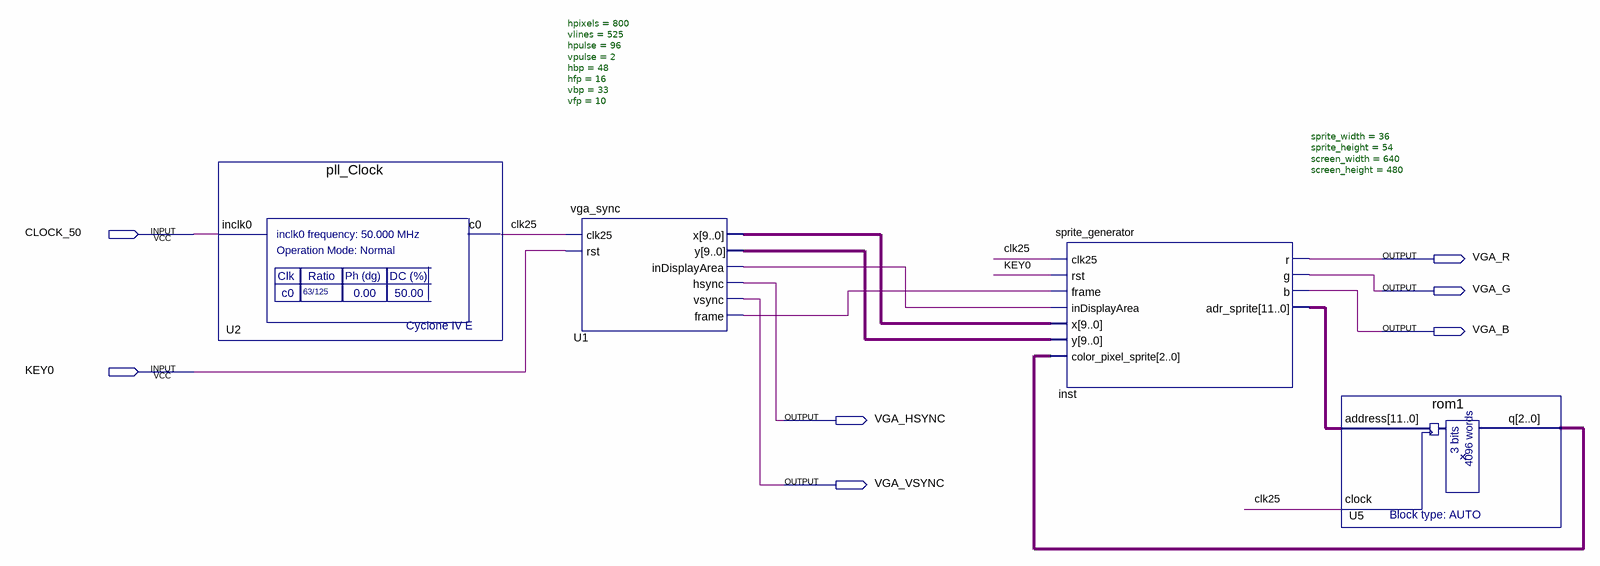
[diagram p0: schematic sheet]
// Quartus schematic Main-Block.bdf as structural Verilog: 4 symbols, 7 pins
module \Main-Block  (
  input  CLOCK_50,
  input  KEY0,
  output VGA_R,
  output VGA_G,
  output VGA_B,
  output VGA_HSYNC,
  output VGA_VSYNC
);

  wire clk25, U1_frame, U1_indisplayarea;
  wire [2:0] U5_q;
  wire [9:0] U1_x, U1_y;
  wire [11:0] inst_adr_sprite;

  pll_Clock U2 (.inclk0(CLOCK_50), .c0(clk25));
  vga_sync #(.hpixels(800), .vlines(525), .hpulse(96), .vpulse(2), .hbp(48), .hfp(16), .vbp(33), .vfp(10)) U1 (
    .clk25(clk25), .rst(KEY0), .x(U1_x), .y(U1_y), .inDisplayArea(U1_indisplayarea), .hsync(VGA_HSYNC),
    .vsync(VGA_VSYNC), .frame(U1_frame));
  sprite_generator #(.sprite_width(36), .sprite_height(54), .screen_width(640), .screen_height(480)) inst (
    .clk25(clk25), .rst(KEY0), .frame(U1_frame), .inDisplayArea(U1_indisplayarea), .x(U1_x), .y(U1_y),
    .color_pixel_sprite(U5_q), .r(VGA_R), .g(VGA_G), .b(VGA_B), .adr_sprite(inst_adr_sprite));
  rom1 U5 (.address(inst_adr_sprite), .clock(clk25), .q(U5_q));
endmodule
